# EAGLE board Motor_Test_Bench (EAGLE 9.5.0)
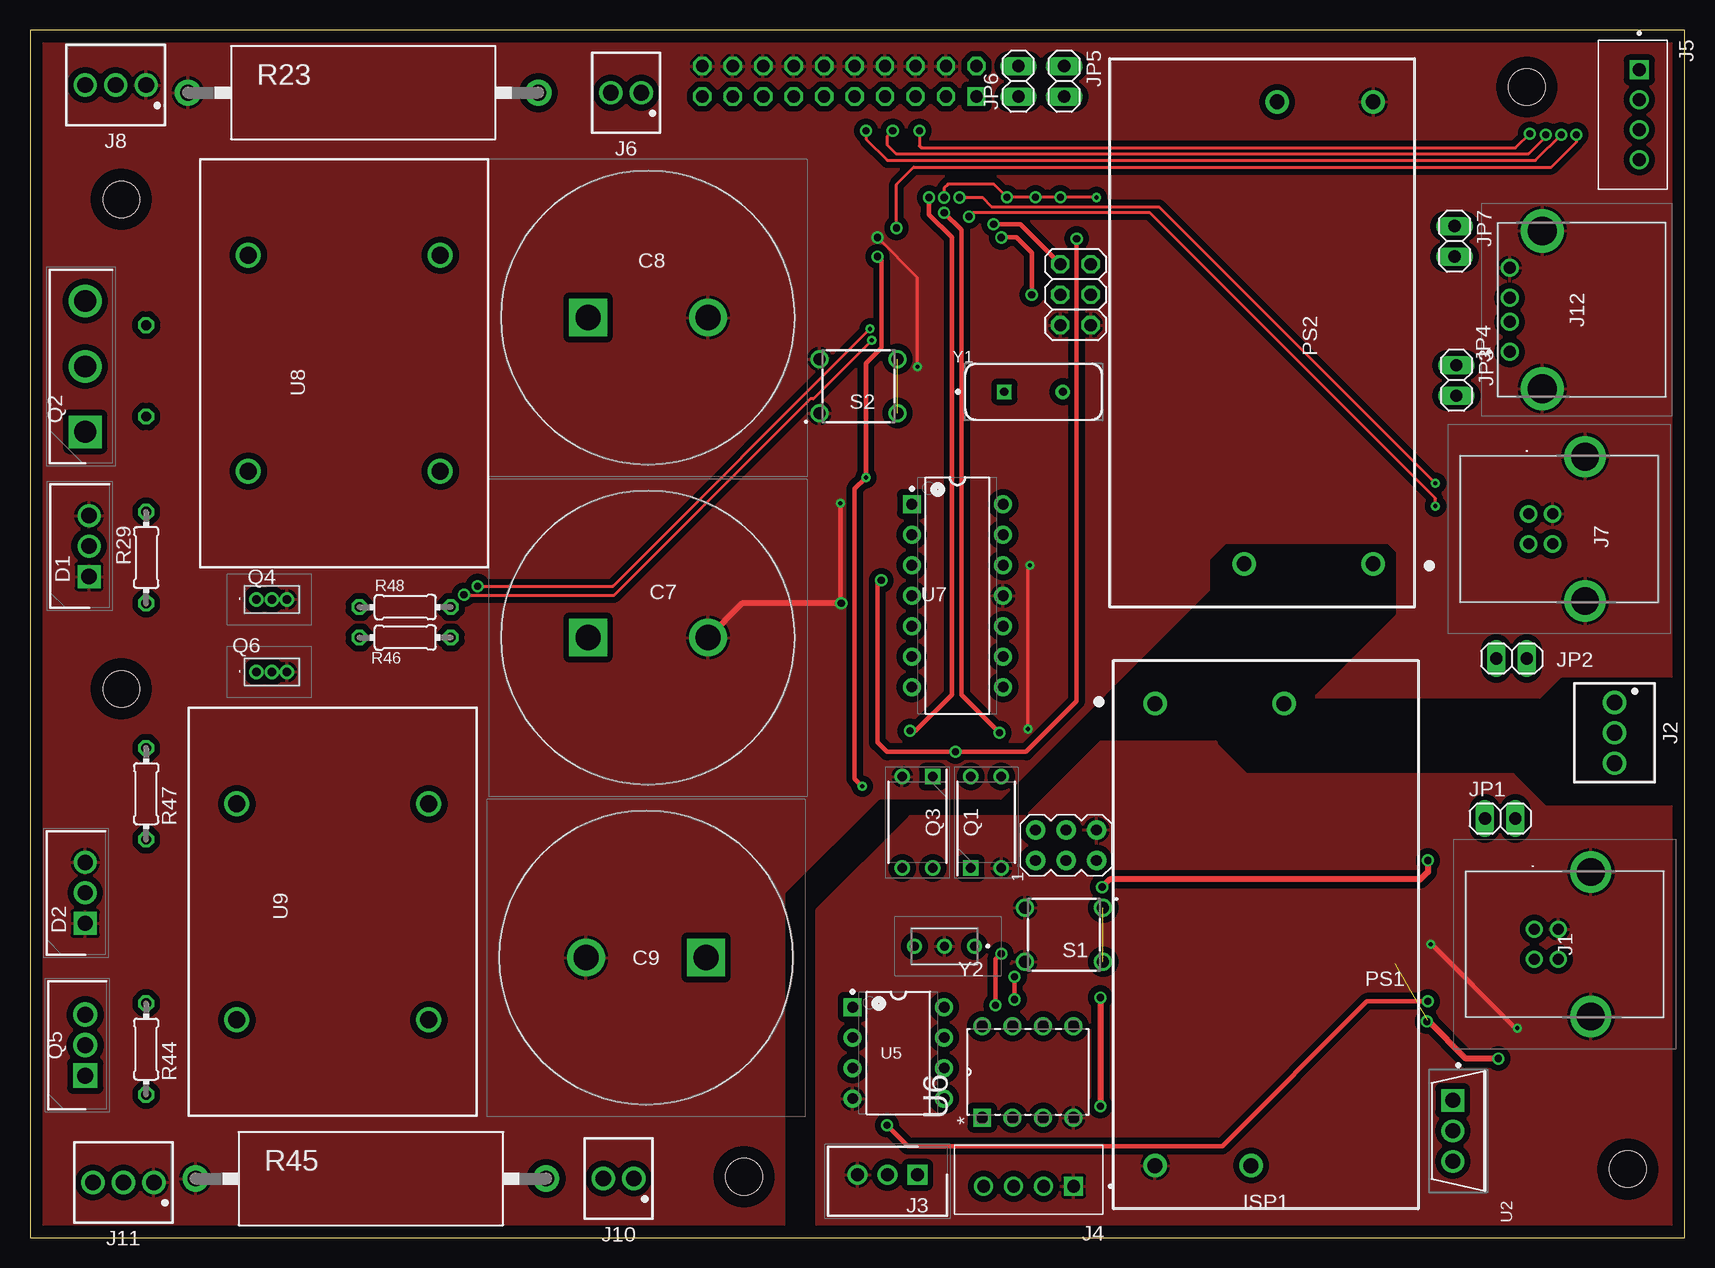
[diagram p5: board, top side]
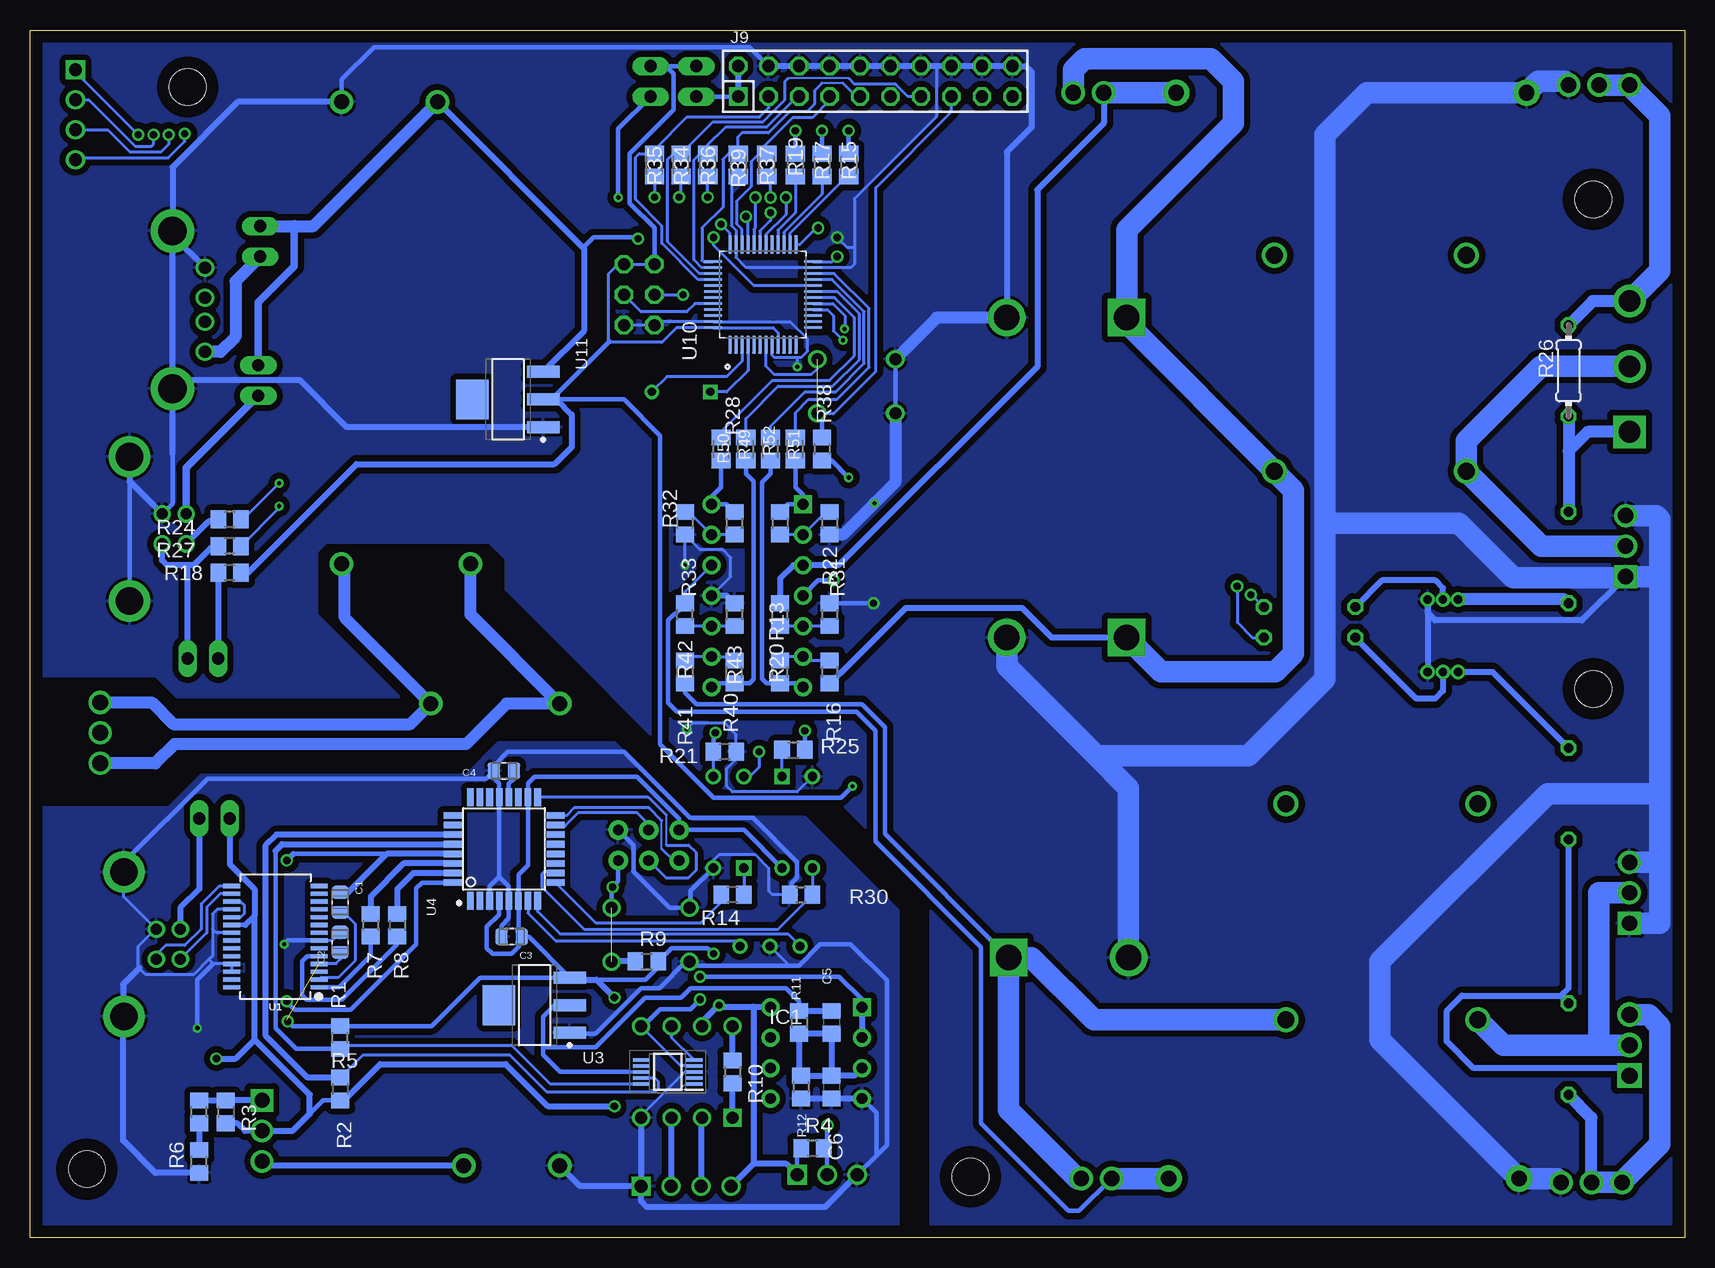
[diagram p6: board, bottom side, seen from below]

Size 137.93 x 100.63 mm. Coordinates in mm from the lower left corner, seen from the top.
Outline: 0,0 137.93,0 137.93,100.63 0,100.63 0,0
Copper layers (1*16): Top 0.035mm / dielectric 1.5mm / Bottom 0.035mm
Design rules "default": minimum track width 6mil, minimum drill 0.35mm, track to track 6mil, track to pad 6mil, pad to pad 6mil, via to via 6mil, smd to smd 6mil, copper to edge 40mil, drill to drill 6mil, minimum pad ring 10mil, minimum via ring 8mil, stop-mask expansion 4mil, vias tented up to drill 0mil, thermal gap 10mil
Holes 3.05 mm at 7.62,86.52 7.62,45.72 59.53,5.08 133.19,5.72 124.78,95.88

## Footprints (pad centres in the part's own frame; a part is rotated, then mirrored left to right if it is on the bottom)
CAP_0805 = smd 1.05 x 1.38: 1 -0.84,0; 2 0.84,0
C0805 = smd 1.3 x 1.5: 1 -0.95,0; 2 0.95,0
SLPX102M200C4P3 = drill 2.1 pad 3.15 square: 1 0,0 | drill 2.1 pad 3.15: 2 10,0
TO254P490X1000X2143-3P = drill 1.28 pad 1.92 square: 1 0,0 | drill 1.28 pad 1.92: 2 2.54,0; 3 5.08,0
SOP50P490X110-10N = smd 1.4 x 0.3: 1 -2.2,1; 2 -2.2,0.5; 3 -2.2,0; 4 -2.2,-0.5; 5 -2.2,-1; 6 2.2,-1; 7 2.2,-0.5; 8 2.2,0; 9 2.2,0.5; 10 2.2,1
AVRISP = drill 0.9 pad 1.626: 1 -1.27,2.54; 2 1.27,2.54; 3 -1.27,0; 4 1.27,0; 5 -1.27,-2.54; 6 1.27,-2.54
UJ2BH1TH = drill 0.92 pad 1.431: 1 1.25,10.81; 2 -1.25,10.81; 3 -1.25,8.81; 4 1.25,8.81 | drill 2.3 pad 3.45: MH1 -6.02,6.1; MH2 6.02,6.1
691210910003 = drill 1.3: 1 -2.54,0; 2 0,0; 3 2.54,0
SHDR3W64P0X250_1X3_990X575X700 = drill 1.1 pad 1.65 square: 1 0,0 | drill 1.1 pad 1.65: 2 2.5,0; 3 5,0
JST_B4B-XH-A(LF)(SN) = drill 1.06 square: 1 0,0 | drill 1.06: 2 2.5,0; 3 5,0; 4 7.5,0
691210910002 = drill 1.3: 1 -1.27,0; 2 1.27,0
JTAG-20 = drill 1.016 square: 1 -11.43,-1.27 | drill 1.016 octagon: 2 -11.43,1.27; 3 -8.89,-1.27; 4 -8.89,1.27; 5 -6.35,-1.27; 6 -6.35,1.27; 7 -3.81,-1.27; 8 -3.81,1.27; 9 -1.27,-1.27; 10 -1.27,1.27; 11 1.27,-1.27; 12 1.27,1.27; 13 3.81,-1.27; 14 3.81,1.27; 15 6.35,-1.27; 16 6.35,1.27; 17 8.89,-1.27; 18 8.89,1.27; 19 11.43,-1.27; 20 11.43,1.27
SS52100001 = drill 1.02 pad 1.53: 1 0,0; 2 2.5,0; 3 4.5,0; 4 7,0 | drill 2.4 pad 3.6: MH1 -3.07,-2.71; MH2 10.07,-2.71
1X02 = drill 1.016 long: 1 -1.27,0; 2 1.27,0
2X03 = drill 1.016 octagon: 1 -2.54,-1.27; 2 -2.54,1.27; 3 0,-1.27; 4 0,1.27; 5 2.54,-1.27; 6 2.54,1.27
IRM-10 = drill 1.24 pad 1.95: 1 3.6,3.45; 2 42.1,3.45; 3 42.1,11.45; 4 3.6,14.2
DIP762W58P254L450H584Q4N = drill 0.78 pad 1.18 square: 1 -3.81,1.27 | drill 0.78 pad 1.18: 2 -3.81,-1.27; 3 3.81,-1.27; 4 3.81,1.27
TO545P521X1594X2566-3P = drill 1.81 pad 2.715 square: 1 0,0 | drill 1.81 pad 2.715: 2 5.45,0; 3 10.9,0
ZTX458 = drill 0.7 pad 1.1: 1 0,0; 2 1.27,0; 3 2.54,0
TO254P483X1028X1700-3P = drill 1.36 pad 2.04 square: 1 0,0 | drill 1.36 pad 2.04: 2 2.54,0; 3 5.08,0
R0805 = smd 1.3 x 1.5: 1 -0.95,0; 2 0.95,0
M0805 = smd 1.3 x 1.6: 1 -0.95,0; 2 0.95,0
RS05_69-70 = drill 1.3 pad 2.2: 1 -14.605,0; 2 14.605,0
0204/7 = drill 0.813 octagon: 1 -3.81,0; 2 3.81,0
1825910-6 = drill 1 pad 1.5: 1 3.25,2.25; 2 3.25,-2.25; 3 -3.25,2.25; 4 -3.25,-2.25
SSOP28DB = smd 0.348 x 1.397: 1 -4.225,-3.656; 2 -3.575,-3.656; 3 -2.925,-3.656; 4 -2.275,-3.656; 5 -1.625,-3.656; 6 -0.975,-3.656; 7 -0.325,-3.656; 8 0.325,-3.656; 9 0.975,-3.656; 10 1.625,-3.656; 11 2.275,-3.656; 12 2.925,-3.656; 13 3.575,-3.656; 14 4.225,-3.656; 15 4.225,3.656; 16 3.575,3.656; 17 2.925,3.656; 18 2.275,3.656; 19 1.625,3.656; 20 0.975,3.656; 21 0.325,3.656; 22 -0.325,3.656; 23 -0.975,3.656; 24 -1.625,3.656; 25 -2.275,3.656; 26 -2.925,3.656; 27 -3.575,3.656; 28 -4.225,3.656
ON_SEMI_LM317BTG_0 = drill 1.25 pad 1.9 square: 1 -0.467,2.54 | drill 1.25 pad 1.9: 2 -0.467,0; 3 -0.467,-2.54
NATIONAL_SEMICONDUCTOR_LM1117IMPX-3.3-NOPB_2 = smd 2.7 x 1: 1 -2.95,2.3; 2 -2.95,0; 3 -2.95,-2.3 | smd 2.7 x 3.3: 4 2.95,0
QFP80P900X900X120-32N = smd 1.5 x 0.55: 1 -4.3,2.8; 2 -4.3,2; 3 -4.3,1.2; 4 -4.3,0.4; 5 -4.3,-0.4; 6 -4.3,-1.2; 7 -4.3,-2; 8 -4.3,-2.8; 17 4.3,-2.8; 18 4.3,-2; 19 4.3,-1.2; 20 4.3,-0.4; 21 4.3,0.4; 22 4.3,1.2; 23 4.3,2; 24 4.3,2.8 | smd 0.55 x 1.5: 9 -2.8,-4.3; 10 -2,-4.3; 11 -1.2,-4.3; 12 -0.4,-4.3; 13 0.4,-4.3; 14 1.2,-4.3; 15 2,-4.3; 16 2.8,-4.3; 25 2.8,4.3; 26 2,4.3; 27 1.2,4.3; 28 0.4,4.3; 29 -0.4,4.3; 30 -1.2,4.3; 31 -2,4.3; 32 -2.8,4.3
TEXAS_INSTRUMENTS_TLC2262CP_0 = drill 0.9 pad 1.5 square: 1 -3.81,3.81 | drill 0.9 pad 1.5: 2 -3.81,1.27; 3 -3.81,-1.27; 4 -3.81,-3.81; 5 3.81,-3.81; 6 3.81,-1.27; 7 3.81,1.27; 8 3.81,3.81
DIP254P762X533-8 = drill 0.991 square: 1 -7.62,7.62 | drill 0.991: 2 -7.62,5.08; 3 -7.62,2.54; 4 -7.62,0; 5 0,0; 6 0,2.54; 7 0,5.08; 8 0,7.62
TEXAS_INSTRUMENTS_TLC2264CN_0 = drill 0.9 pad 1.5 square: 1 -3.81,7.62 | drill 0.9 pad 1.5: 2 -3.81,5.08; 3 -3.81,2.54; 4 -3.81,0; 5 -3.81,-2.54; 6 -3.81,-5.08; 7 -3.81,-7.62; 8 3.81,-7.62; 9 3.81,-5.08; 10 3.81,-2.54; 11 3.81,0; 12 3.81,2.54; 13 3.81,5.08; 14 3.81,7.62
SC-10-30J = drill 1.4 pad 2.1: 1 -9,-8; 2 9,-8; 3 9,8; 4 -9,8
QFP50P900X900X160-48N = smd 1.56 x 0.28: 1 -4.18,2.75; 2 -4.18,2.25; 3 -4.18,1.75; 4 -4.18,1.25; 5 -4.18,0.75; 6 -4.18,0.25; 7 -4.18,-0.25; 8 -4.18,-0.75; 9 -4.18,-1.25; 10 -4.18,-1.75; 11 -4.18,-2.25; 12 -4.18,-2.75; 25 4.18,-2.75; 26 4.18,-2.25; 27 4.18,-1.75; 28 4.18,-1.25; 29 4.18,-0.75; 30 4.18,-0.25; 31 4.18,0.25; 32 4.18,0.75; 33 4.18,1.25; 34 4.18,1.75; 35 4.18,2.25; 36 4.18,2.75 | smd 0.28 x 1.56: 13 -2.75,-4.18; 14 -2.25,-4.18; 15 -1.75,-4.18; 16 -1.25,-4.18; 17 -0.75,-4.18; 18 -0.25,-4.18; 19 0.25,-4.18; 20 0.75,-4.18; 21 1.25,-4.18; 22 1.75,-4.18; 23 2.25,-4.18; 24 2.75,-4.18; 37 2.75,4.18; 38 2.25,4.18; 39 1.75,4.18; 40 1.25,4.18; 41 0.75,4.18; 42 0.25,4.18; 43 -0.25,4.18; 44 -0.75,4.18; 45 -1.25,4.18; 46 -1.75,4.18; 47 -2.25,4.18; 48 -2.75,4.18
FOX_ELECTRONICS_FOXSLF-080-20_0 = drill 0.7 pad 1.2 square: 1 -2.44,0 | drill 0.7 pad 1.2: 2 2.44,0
CSTLS16M0X53ZA0 = drill 0.73 pad 1.251: 1 0,0; 2 -2.5,0; 3 -5,0

## Placement (x,y rotation side)
C1  100n  [CAP_0805]  112.08,27.94 270 bottom
C2  100n  [CAP_0805]  112.08,24.61 90 bottom
C3  100n  [CAP_0805]  97.79,25.08 180 bottom
C4  100n  [CAP_0805]  98.42,38.89 180 bottom
C5  100n  [C0805]  71.12,17.94 270 bottom
C6  100n  [C0805]  71.12,12.54 270 bottom
C7  1000µ  [SLPX102M200C4P3]  46.51,50.01 0 top
C8  1000µ  [SLPX102M200C4P3]  46.51,76.68 0 top
C9  1000µ  [SLPX102M200C4P3]  56.36,23.34 180 top
D1  MBRF10200CT  [TO254P490X1000X2143-3P]  4.92,55.09 90 top
D2  MBRF10200CT  [TO254P490X1000X2143-3P]  4.6,26.19 90 top
IC1  ADS1115BQDGSRQ1  [SOP50P490X110-10N]  84.77,13.81 180 bottom
ISP1  AVRISP-6  [AVRISP]  86.36,32.7 90 top
J1  UJ2-BH-1-TH  [UJ2BH1TH]  136.21,24.45 90 top
J2  [691210910003]  132.08,42.07 270 top
J3  B3B-XH-A(LF)(SN)  [SHDR3W64P0X250_1X3_990X575X700]  73.98,5.24 180 top
J4  B4B-XH-A(LF)(SN)  [JST_B4B-XH-A(LF)(SN)]  87,4.29 180 top
J5  B4B-XH-A(LF)(SN)  [JST_B4B-XH-A(LF)(SN)]  134.14,97.31 270 top
J6  [691210910002]  49.69,95.41 180 top
J7  UJ2-BH-1-TH  [UJ2BH1TH]  135.73,59.05 90 top
J8  [691210910003]  7.14,96.04 180 top
J9  JTAG-20  [JTAG-20]  67.47,96.36 0 bottom
J10  [691210910002]  49.05,4.92 180 top
J11  [691210910003]  7.78,4.6 180 top
J12  SS-52100-001  [SS52100001]  123.35,73.82 90 top
JP1  [1X02]  122.55,34.92 0 top
JP2  [1X02]  123.51,48.26 0 top
JP3  [1X02]  118.9,71.44 270 top
JP4  [2X03]  87.15,78.58 270 top
JP5  [1X02]  86.2,96.36 270 top
JP6  [1X02]  82.39,96.36 270 top
JP7  [1X02]  118.75,83.03 270 top
PS1  IRM-10-12  [IRM-10]  90.33,48.1 270 top
PS2  IRM-10-5  [IRM-10]  115.41,52.55 90 top
Q1  TIL191  [DIP762W58P254L450H584Q4N]  79.69,34.61 90 top
Q2  IXTX32P60P  [TO545P521X1594X2566-3P]  4.6,67.15 90 top
Q3  TIL191  [DIP762W58P254L450H584Q4N]  73.98,34.61 270 top
Q4  ZTX458  [ZTX458]  18.89,53.18 0 top
Q5  IXTP10P50P  [TO254P483X1028X1700-3P]  4.6,13.49 90 top
Q6  ZTX458  [ZTX458]  18.89,47.15 0 top
R1  10k  [R0805]  112.08,16.67 90 bottom
R2  10k  [R0805]  112.08,12.38 270 bottom
R3  240  [R0805]  121.6,10.48 270 bottom
R4  10k  [R0805]  72.71,7.46 0 bottom
R5  680  [R0805]  123.83,10.48 90 bottom
R6  47  [R0805]  123.83,6.35 90 bottom
R7  1k  [R0805]  109.54,26.04 270 bottom
R8  1k  [R0805]  107.31,26.04 270 bottom
R9  10k  [R0805]  86.52,23.02 0 bottom
R10  100  [R0805]  79.38,13.81 270 bottom
R11  10k  [R0805]  73.82,17.94 270 bottom
R12  10k  [R0805]  73.66,12.54 270 bottom
R13  1k2  [R0805]  75.41,47.15 90 bottom
R14  100  [R0805]  79.38,28.58 180 bottom
R15  33  [M0805]  69.69,89.38 90 bottom
R16  470k  [R0805]  71.28,47.15 270 bottom
R17  33  [M0805]  71.91,89.38 90 bottom
R18  1k5  [R0805]  121.28,55.4 180 bottom
R19  33  [M0805]  74.14,89.38 90 bottom
R20  470k  [R0805]  75.41,51.91 90 bottom
R21  10k  [R0805]  80.01,40.48 180 bottom
R22  1k2  [R0805]  71.28,51.91 270 bottom
R23  0R05  [RS05_69-70]  27.78,95.41 0 top
R24  22  [R0805]  121.28,59.85 180 bottom
R25  100  [R0805]  74.3,40.64 0 bottom
R26  1k  [0204/7]  9.68,72.23 90 bottom
R27  22  [R0805]  121.28,57.63 180 bottom
R28  560k  [R0805]  75.41,59.53 270 bottom
R29  1k  [0204/7]  9.68,56.67 90 top
R30  10k  [R0805]  73.66,28.58 0 bottom
R31  82k  [R0805]  71.28,59.53 270 bottom
R32  560k  [R0805]  79.22,59.53 270 bottom
R33  82k  [R0805]  83.34,59.53 270 bottom
R34  10k  [M0805]  83.66,89.38 270 bottom
R35  10k  [M0805]  85.88,89.38 270 bottom
R36  10k  [M0805]  81.44,89.38 270 bottom
R37  10k  [M0805]  76.52,89.38 270 bottom
R38  10k  [R0805]  71.91,65.72 270 bottom
R39  10k  [M0805]  78.9,89.38 90 bottom
R40  1k2  [R0805]  79.22,47.15 90 bottom
R41  470k  [R0805]  83.34,47.15 270 bottom
R42  470k  [R0805]  83.34,51.91 90 bottom
R43  1k2  [R0805]  79.22,51.91 270 bottom
R44  1k  [0204/7]  9.68,15.72 270 top
R45  0R05  [RS05_69-70]  28.42,4.92 0 top
R46  10k  [0204/7]  31.27,50.01 0 top
R47  1k  [0204/7]  9.68,36.99 270 top
R48  10k  [0204/7]  31.27,52.55 0 top
R49  10k  [M0805]  78.26,65.72 270 bottom
R50  10k  [M0805]  80.33,65.72 270 bottom
R51  10k  [M0805]  74.14,65.72 270 bottom
R52  10k  [M0805]  76.2,65.72 270 bottom
S1  1825910-6  [1825910-6]  86.2,25.24 0 top
S2  1825910-6  [1825910-6]  69.06,70.96 180 top
U1  FT232RL  [SSOP28DB]  117.47,25.08 90 bottom
U2  ON_SEMI_LM317BTGON_SEMI_LM317BTG_0_0  [ON_SEMI_LM317BTG_0]  119.06,8.89 0 top
U3  NATIONAL_SEMICONDUCTOR_LM1117IMPX-3.3-NOPBNATIONAL_SEMICONDUCTOR_LM1117IMPX-3.3-NOPB_0_2  [NATIONAL_SEMICONDUCTOR_LM1117IMPX-3.3-NOPB_2]  95.89,19.37 180 bottom
U4  ATMEGA328P-AN  [QFP80P900X900X120-32N]  98.42,32.38 90 bottom
U5  TEXAS_INSTRUMENTS_TLC2262CPTEXAS_INSTRUMENTS_TLC2262CP_0_0  [TEXAS_INSTRUMENTS_TLC2262CP_0]  72.39,15.4 0 top
U6  AD623ANZ  [DIP254P762X533-8]  87,17.62 90 top
U7  TEXAS_INSTRUMENTS_TLC2264CNTEXAS_INSTRUMENTS_TLC2264CN_0_0  [TEXAS_INSTRUMENTS_TLC2264CN_0]  77.31,53.5 0 top
U8  SC-10-30J  [SC-10-30J]  26.19,72.87 90 top
U9  SC-10-30J  [SC-10-30J]  25.24,27.15 270 top
U10  STM32F103C8T6  [QFP50P900X900X160-48N]  76.83,78.58 90 bottom
U11  NATIONAL_SEMICONDUCTOR_LM1117IMPX-3.3-NOPBNATIONAL_SEMICONDUCTOR_LM1117IMPX-3.3-NOPB_0_2  [NATIONAL_SEMICONDUCTOR_LM1117IMPX-3.3-NOPB_2]  98.11,69.85 180 bottom
Y1  FOX_ELECTRONICS_FOXSLF-080-20FOX_ELECTRONICS_FOXSLF-080-20_0_0  [FOX_ELECTRONICS_FOXSLF-080-20_0]  83.66,70.48 0 top
Y2  CSTLS16M0X53Z-A0  [CSTLS16M0X53ZA0]  78.74,24.29 0 top

## Tracks (layer width: path | path; a pad name or v marks a point on that pad's centre or on a via)
1V65  (via drill 0.6)
  Top 0.381: v82.07,19.84 v82.07,21.75
  Bottom 0.254: IC1.4 83.68,14.31 U6.5
  Bottom 0.381: U5.1 68.58,19.84 70.48,21.75 v82.07,21.75 | v82.07,19.84 82.87,19.05 85.41,19.05 86.84,17.62 U6.5
  Bottom 0.508: U5.1 U5.2
3V3_D
  Bottom 0.254: 87.95,13.81 IC1.8
  Bottom 0.381: R11.1 73.82,19.68 74.93,20.8 82.87,20.8 83.66,20 86.68,20 90.8,15.87 95.16,15.87 | 87.95,13.81 93.73,13.81 95.16,15.24 95.16,15.87 | U3.2 94.2,19.37 95.16,18.41 95.16,15.87
  Bottom 0.508: R11.1 C5.1
3V3_FTDI
  Bottom 0.254: U1.17 120.4,28.01 120.07,27.68 120.07,26.99 120.35,26.71 U1.19
5V_D  (via drill 0.6)  (1 unrouted)
  Top 0.381: v80.96,23.65 80.49,23.18 v80.49,19.37
  Top 0.508: v89.22,20 v89.22,10.95 | v122.4,14.92 119.7,14.92 116.6,18.02 v116.44,18.02
  Bottom 0.254: C2.1 112.08,23.18 112.45,22.81 U1.4 | 116.52,18.1 v116.44,18.02
  Bottom 0.381: J3.1 73.98,7.14 R4.1 | Q3.4 78.42,33.97 ISP1.2 83.82,34.92 87.31,38.42 95.88,38.42 96.42,37.88 U4.18 96.42,31.05 97.22,30.25 U4.6 97.22,25.36 C3.1 | U1.20 119.99,26.06 | C3.1 97.15,24.88 97.15,24.29 97.79,23.65 99.38,23.65 99.85,24.13 99.85,25.89 98.82,26.92 U4.4 | U3.3 100.41,21.67 104.46,17.62 R1.2 112.55,17.62 116.05,17.62 v116.44,18.02 | U3.3 92.76,21.49 86.62,21.49 85.57,22.54 R9.2 84.46,24.13 81.44,24.13 v80.96,23.65 | C3.1 96.35,25.08 U3.3 | 112.24,11.27 R2.2 113.5,11.43 114.62,10.32 | 121.13,35.08 JP1.1 | v80.49,19.37 80.49,19.25
  Bottom 0.508: U6.7 81.91,17.99 80.65,19.25 80.49,19.25 77.63,19.25 | 77.63,19.25 76.24,19.25 U5.8 | 77.63,19.25 77.63,6.15 | 77.63,6.15 J4.4 | J3.1 74.89,6.15 77.63,6.15 | JP1.1 121.28,31.11 119.22,29.05 119.22,26.83 | 119.22,26.83 119.99,26.06 | R3.2 120.65,9.53 120.01,8.89 U2.2 116.05,8.89 114.62,10.32 114.62,11.91 119.22,16.51 | 119.22,16.51 119.22,26.83 | R2.2 111.76,11.43 108.74,14.45 98.27,14.45 94.77,10.95 v89.22,10.95 | v89.22,20 90.72,21.51 92.78,21.51 U3.3 | v122.4,14.92 120.81,14.92 119.22,16.51
5V_RPI
  Bottom 1.016: JP7.2 120.81,79.69 120.81,75.09 122.08,73.82 J12.1
12V_D
  Bottom 0.508: PS1.3 118.25,6 U2.3
230V_N
  Bottom 1.016: PS2.4 101.21,51.93 PS1.1 98.21,44.5 101.6,41.12 125.89,41.12 127.48,39.53 J2.3
230V_P
  Bottom 1.016: PS2.1 111.69,55.88 111.69,51.66 PS1.4 106.24,42.79 125.98,42.79 127.79,44.61 J2.1
+3V3  (via drill 0.35, 0.6)
  Top 0.381: v80.33,84.45 82.55,84.45 JP4.1 | v69.37,37.62 68.74,38.26 68.74,53.34 68.74,62.39 v69.69,63.34 69.69,72.87 70.96,74.14 70.96,81.44 v70.64,81.76
  Bottom 0.254: U10.9 75.58,75.43 75.99,75.83 U10.48 84.03,75.83 85.25,74.61 89.53,74.61 89.61,74.69 89.69,74.77 89.69,80.33 88.9,81.12 JP4.2 JP4.1 | U10.36 79.58,83.71 v80.33,84.45 | U10.24 71.07,81.33 v70.64,81.76
  Bottom 0.381: 89.61,74.69 94.46,69.85 U11.2 88.42,69.85 85.41,66.83 85.41,41.12 80.96,36.67 70.33,36.67 v69.37,37.62 | v69.69,63.34 71.12,64.77 R38.2 | JP4.1 85.88,84.14 87.95,86.2 87.95,90.33 84.3,93.98 84.3,97 84.93,97.63 JP5.1 JP6.1
  Bottom 0.508: R18.1 119.76,55.4 110.71,64.45 94.2,64.45 92.78,65.88 92.78,68.58 94.05,69.85 U11.2
+5V  (via drill 0.6)
  Top 0.381: v87.25,83.25 87.25,44.7 83.03,40.48 v77.15,40.48 71.44,40.48 70.64,41.27 70.64,54.45 v70.96,54.77
  Bottom 0.254: v77.15,40.48 77.15,39.21 77.95,38.42 Q1.4
  Bottom 0.381: 91.81,82.5 90.96,83.34 87.34,83.34 v87.25,83.25 | v70.96,54.77 72.23,54.77 U7.4
  Bottom 0.508: PS2.3 91.81,82.5 91.76,82.44 91.76,75.55 U11.3
  Bottom 0.635: 115.9,84.3 115.9,80.95 118.9,77.95 JP3.1
  Bottom 1.016: PS2.3 114.31,84.3 115.9,84.3 JP7.1
BOOT0
  Bottom 0.254: U10.44 82.51,77.83 83.18,77.15 86.99,77.15 JP4.4
BOOT1  (via drill 0.6)
  Top 0.381: v80.96,83.34 82.23,83.34 83.5,82.07 v83.5,78.58
  Bottom 0.254: U10.20 77.58,79.33 80.96,82.71 v80.96,83.34 | JP4.3 v83.5,78.58
GND  (via drill 0.35, 0.6)
  Top 0.254: v73.98,72.57 73.98,80.01 v70.64,83.34 | v83.18,42.39 83.18,55.88 v83.34,56.04
  Top 0.381: v67.55,61.2 67.55,52.94 v67.63,52.86
  Top 0.508: v67.63,52.86 59.37,52.86 C7.2
  Bottom 0.254: U7.11 79.53,55.09 79.53,56.67 80.17,57.31 82.07,57.31 83.26,58.5 | 83.26,58.5 R33.2 | R39.1 79.46,87.86 79.46,84.34 79.08,83.96 U10.35 79.08,81.68 78.24,80.83 U10.23 69.5,80.83 69.21,81.12 69.21,82.55 | Q3.2 73.98,37.15 79.37,37.15 79.85,37.62 79.85,39.05 79.06,39.85 R21.1 79.06,41.91 80.01,42.86 82.71,42.86 v83.18,42.39 | 73.98,73.34 73.66,73.34 73.18,73.82 73.18,74.93 74.58,76.33 U10.47 85.59,76.33 JP4.5 JP4.6 | 73.98,73.34 75.88,73.34 76.08,73.54 U10.8 | 62.39,97.63 62.39,93.41 69.21,86.58 69.21,82.55 | 73.98,73.34 v73.98,72.57 | v70.64,83.34 69.85,82.55 69.21,82.55 | v83.34,56.04 83.34,58.42 83.26,58.5
  Bottom 0.381: J7.MH2 J7.MH1 | J7.4 126.06,61.17 126.06,65.34 | J9.4 77.94,99.21 109.26,99.21 111.96,96.51 PS2.2 | v67.63,52.86 R22.1 | S2.2 S2.1
  Bottom 0.508: PS2.2 120.62,94.65 126.06,89.21 J12.MH2 126.06,83.5 | J12.MH1 126.06,83.5 | 126.06,65.34 J12.MH1 | J9.4 J9.6 J9.8 J9.10 J9.12 J9.14 62.39,97.63 J9.16 J9.18 J9.20 54.93,97.63 54.45,97.15 54.45,92.55 56.51,90.49 C8.2 | R43.1 79.85,53.5 U7.11 | J7.MH2 129.63,63.01 J7.4 | J12.4 126.03,83.5 126.06,83.5 | U11.1 111.52,67.55 115.41,71.44 125.37,71.44 J12.MH1 | Q6.3 Q4.3 21.43,52.07 20.8,51.43 8.57,51.43 D1.1
  Bottom 1.016: C8.2 62.34,76.68 S2.2 | S2.1 65.81,62.94 v67.55,61.2 70.17,58.58 R31.2
  Bottom 1.778: 30,59.53 30,91.92 26.51,95.41 R23.1 12.22,96.36 10,96.36 J8.1 | 30,59.53 30,46.51 36.35,40.16 49.05,40.16 | C7.2 56.51,47.62 49.05,40.16 | D1.3 2.38,60.17 2.06,59.85 2.06,55.09 | 2.06,55.09 D1.1 5.02,54.99 14.27,54.99 18.81,59.53 30,59.53 | 2.06,30.96 2.38,31.27 D2.3 | 2.06,30.96 2.06,26.19 D2.1 | 2.06,30.96 2.06,36.99 | 2.06,36.99 2.06,55.09 | J11.1 10.64,4.92 R45.1 25.4,16.51 25.4,23.02 11.43,36.99 2.06,36.99 | C9.2 46.36,37.47 49.05,40.16
  pour Bottom (isolate 0.508): 0,0 0,100.49 137.79,100.49 137.79,46.83 127.48,46.83 125.73,45.09 107.16,45.09 113.98,51.91 113.98,57.15 113.19,57.94 99.69,57.94 98.27,56.52 98.27,53.97 80.96,36.67 70.8,36.67 62.87,28.73 62.87,0
  pour Top (isolate 0.508): 137.79,100.65 0,100.65 0,0 62.71,0 62.87,-0.16 62.87,28.73 70.8,36.67 80.96,36.67 98.27,53.97 98.27,56.52 99.69,57.94 113.19,57.94 113.98,57.15 113.98,51.91 107.16,45.09 125.89,45.09 127.64,46.83 137.79,46.83
GND_BRK
  Bottom 0.254: U7.12 83.34,53.82 R42.2 83.34,52.76 83.45,52.65
  Bottom 0.381: J10.2 50.48,2.22 51.36,2.22 58.66,9.52 58.66,24.21 67.47,33.02 67.47,42.23 69.06,43.81 83.98,43.81 84.75,44.59 84.75,51.44 84.24,51.95 84.15,51.95 83.45,52.65
  Bottom 1.778: R45.2 J10.2
GND_D  (via drill 0.35)
  Top 0.381: v123.98,17.46 123.82,17.46 116.84,24.45 v116.75,24.45
  Bottom 0.152: 74.79,22.84 74.62,22.67
  Bottom 0.254: R30.1 76.04,28.57 76.36,28.89 76.36,30.8 77.47,31.91 80.49,31.91 80.96,31.43 Q1.2 | IC1.3 83.34,13.81 86.99,10.16 U6.4 | U1.18 122.34,27.36 122.71,26.99 122.71,25.72 | 122.71,25.72 122.71,23.49 123.03,23.18 | 123.03,23.18 124.3,21.91 128.27,21.91 128.83,22.46 128.9,22.54 128.9,24.29 127.5,25.7 J1.4 130.11,28.41 J1.MH2 130.11,31.28 | U1.26 U1.25 122.66,22.81 123.03,23.18 | U1.21 122.4,25.41 122.71,25.72 | C2.2 112.77,24.76 U1.7 | Y2.2 74.79,22.84
  Bottom 0.381: 67.39,6.83 67.39,10.4 U5.4 | J3.3 67.39,6.83 | ISP1.6 87.63,32.7 87.63,30.48 84.64,27.49 S1.3 82.87,27.49 82.87,28.89 Q1.2 | C4.2 99.26,38.3 98.82,37.86 U4.21 98.82,30.08 | U4.3 99.62,29.28 98.82,30.08 | 98.82,30.08 98.02,29.28 U4.5 98.02,26.59 98.63,25.99 C3.2 | R30.1 74.45,28.73 74.45,29.53 73.98,30 73.98,31.27 77.67,34.97 82.91,34.97 88.42,40.48 98.11,40.48 99.26,39.32 C4.2 | S1.4 83.59,22.99 | U3.1 92.85,16.99 90.8,16.99 86.99,20.8 85.46,20.8 83.27,22.99 S1.4 | S1.4 82.63,22.67 74.62,22.67 73.85,22.67 72.07,24.45 69.53,24.45 66.52,21.43 66.52,7.7 67.39,6.83 | 122.66,22.81 123.98,21.48 v123.98,17.46 | v116.75,24.45 116.44,24.76 U1.7 | C4.2 99.9,38.25 123.14,38.25 130.11,31.28
  Bottom 0.508: U5.4 C6.2 R12.2 | U6.4 J4.1 | J4.1 92.06,4.29 PS1.2 | R6.1 127.48,5.4 130.17,8.1 130.17,18.36 | 130.17,18.36 J1.MH1 | 128.83,22.46 130.17,21.11 130.17,18.36 | J3.3 71.68,2.54 86.52,2.54 86.99,3.02 J4.1
  pour Bottom (isolate 0.508): 137.95,35.88 126.36,35.88 123.67,38.58 101.6,38.58 98.9,41.27 89.22,41.27 83.03,35.08 73.34,35.08 65.56,27.3 65.56,0 137.95,0
  pour Top (isolate 0.508): 137.95,0 137.95,35.88 126.36,35.88 123.67,38.58 101.44,38.58 98.9,41.12 98.9,41.27 89.22,41.27 83.03,35.08 73.34,35.08 65.56,27.3 65.56,0
GND_MOT
  Bottom 0.508: J6.2 48.42,92.87 53.97,87.31 53.97,72.59 70.53,56.04 U7.3 74.29,56.04 75.41,54.93 R20.2
  Bottom 1.778: R23.2 J6.2
IN_100V_BRAKE
  Bottom 1.016: J11.2 7.78,10 R44.2
  Bottom 1.778: Q5.3 3.02,18.57 2.06,17.62 2.06,7.78 J11.3 J11.2
IN_100V_MOTOR
  Bottom 1.016: Q2.3 7.67,78.05 R26.2
  Bottom 1.778: Q2.3 2.06,80.59 2.06,93.5 J8.3 J8.2
JNTRST
  Bottom 0.254: J9.3 76.36,94.14 77.15,93.34 83.18,93.34 85.88,90.65 R35.1 | R35.1 | R35.1 87.15,90.33 87.47,90.01 87.47,86.52 85.25,84.3 85.25,82.85 82.23,79.83 U10.40
JTCK
  Bottom 0.152: 70.17,96.2 71.91,96.2
  Bottom 0.254: 70.17,96.2 69.06,95.09 J9.9 | U10.37 81.81,81.33 81.91,81.44 81.91,84.14 80.17,85.88 80.17,89.85 79.69,90.33 R39.2 78.9,91.74 78.58,92.05 76.38,92.05 74.61,93.82 73.18,93.82 72.55,94.46 72.55,95.57 71.91,96.2
JTDI
  Bottom 0.254: J9.5 73.98,95.09 76.54,92.53 79.97,92.53 81.44,91.06 R36.1 82.07,90.33 82.58,89.82 82.58,81.47 81.94,80.83 U10.38
JTDO
  Bottom 0.152: 69.68,96.61 74.73,96.61
  Bottom 0.254: J9.13 64.73,95.09 65.77,96.13 69.21,96.13 69.68,96.61 | 74.73,96.61 75.02,96.32 75.02,94.8 76.88,92.94 81.05,92.94 R34.1 84.3,90.33 84.77,89.85 84.77,82.98 82.13,80.33 U10.39
JTMS
  Bottom 0.254: U10.34 78.58,84.03 79.06,84.5 79.06,86.36 77.79,87.63 77.79,89.69 77.15,90.33 76.83,90.33 | 76.83,90.33 R37.1 | J9.7 71.28,94.77 72.72,93.33 74.37,93.33 76.83,90.87 76.83,90.33
LOAD_CELL_NEG
  Bottom 0.508: U6.2 81.99,9.92 J4.3
LOAD_CELL_POS
  Bottom 0.508: U6.3 84.49,9.96 J4.2
MES_I_BRAKE
  Bottom 0.254: R50.1 80.33,67.15 76.04,71.44 71.28,71.44 69.21,73.5 69.21,76.68 70.87,78.33 U10.18
MES_I_MOTOR
  Bottom 0.254: R51.1 74.14,68.74 73.02,69.85 70.67,69.85 68,72.52 68,77.43 70.89,80.33 U10.22
MES_LOAD_CELL
  Bottom 0.254: U6.6 84.48,17.6 84.48,16.72 IC1.5
MES_U_BRAKE
  Bottom 0.254: R49.1 78.26,68.26 75.56,70.96 71.02,70.96 68.81,73.17 68.81,77 70.64,78.83 U10.19
MES_U_MOTOR
  Bottom 0.254: R52.1 76.2,67.62 73.34,70.48 70.76,70.48 68.4,72.85 68.4,77.17 71.06,79.83 U10.21
MISO_ATM
  Bottom 0.152: 85.27,32.4 85.27,34.74
  Bottom 0.254: ISP1.1 84.3,31.43 85.27,32.4 | U4.16 93.18,35.18 92.56,35.81 86.33,35.81 85.27,34.74
MOSI_ATM
  Bottom 0.254: ISP1.4 86.36,34.45 87.31,35.4 92.23,35.4 93.32,34.31 94.05,34.31 U4.15
N$1
  Bottom 1.778: Q2.2 12,72.6 18.19,66.41 U8.4 11.95,57.63 D1.2
N$3
  Bottom 0.508: R5.1 R6.2
N$5
  Bottom 0.508: U2.1 R3.1 R5.2
N$6
  Bottom 0.508: R24.2 122.39,59.69 123.04,59.69 J7.2
N$7
  Bottom 0.508: R27.2 122.39,57.47 122.87,57.47 124.3,56.04 124.78,56.04 | 124.78,56.04 126.52,56.04 126.92,56.44 J7.3 | JP2.2 124.78,56.04
N$8
  Bottom 0.508: R18.2 JP2.1
N$9
  Bottom 0.254: R28.2 U7.2 71.6,60.48 R31.1
N$10
  Bottom 1.016: Q2.1 8.1,67.15 9.68,65.56 | R26.1 9.68,65.56 | 9.68,65.56 R29.2
N$11
  Bottom 1.016: R29.1 10,53.18 Q4.1
N$12
  Bottom 0.254: R13.2 75.09,48.42 U7.6 73.18,48.1 R16.1
N$13
  Bottom 0.254: R22.2 U7.5 R20.1
N$14
  Bottom 0.254: U1.2 113.62,21.7 112.2,21.7 110.79,23.11 110.79,26.1 111.79,27.1 C1.2
N$15
  Bottom 0.381: C4.1 97.58,38.26 98.02,37.82 U4.20
N$16
  Bottom 0.508: Q5.1 5.24,14.13 17.62,14.13 19.84,16.35 19.84,18.89 18.57,20.16 10.32,20.16 | R44.1 10.32,20.16 | 10.32,20.16 9.68,20.8 R47.2
N$17
  Bottom 0.254: R32.2 U7.13 83.02,60.48 R33.1
N$18
  Bottom 0.508: Q6.2 20.16,45.56 20.8,44.93 22.38,44.93 R46.1
N$19
  Bottom 0.254: R43.2 U7.10 R42.1
N$20
  Bottom 0.254: R40.2 79.54,48.42 U7.9 83.02,48.42 R41.1
N$21
  Bottom 0.508: Q4.2 20.16,54.13 20.8,54.77 25.24,54.77 R48.1
N$22
  Bottom 0.508: Q6.1 16.03,47.15 R47.1
N$23
  Bottom 0.254: 74.14,64.61 R51.2
  Bottom 0.381: R28.1 74.77,61.12 U7.1 73.5,61.91 74.14,62.55 74.14,64.61
N$25
  Bottom 0.254: J1.2 123.19,25.4 123.19,27.53 122.07,28.66 U1.16
N$26
  Bottom 0.508: U6.1 R10.2
N$27
  Bottom 0.508: C6.1 R12.1 73.82,13.65 R11.2 C5.2 C6.1 | U5.3 69.22,13.49 C6.1
N$28
  Bottom 0.508: R10.1 U6.8
N$29
  Bottom 0.254: J1.3 127.4,23.56 126.6,24.35 125.03,24.35 123.67,25.72 123.67,27.78 122.14,29.31 U1.15
N$32
  Bottom 1.778: D2.2 7.14,28.73 7.14,16.03 | 7.14,16.03 Q5.2 | 7.14,16.03 9.68,16.03 10,16.03 15.13,16.03 U9.2
N$34
  Bottom 0.254: Q1.1 R14.1
N$35
  Bottom 0.254: Q3.1 R25.1
N$36
  Bottom 0.635: JP3.2 124.92,64.15 J7.1
N$37
  Bottom 0.381: JP6.2 J9.1
  Bottom 0.508: J9.2 J9.1
N$38  (via drill 0.35, 0.6)
  Top 0.254: v85.88,86.7 85.86,86.68 83.84,86.68 v83.82,86.7 83.8,86.68 81.46,86.68 v81.44,86.7 80.35,87.79 76.52,87.79 76.2,87.47 v76.2,86.68 | v88.9,86.68 85.91,86.68
  Top 0.381: 85.91,86.68 v85.88,86.7
  Bottom 0.254: R35.2 v85.88,86.7 | v83.82,86.7 83.66,86.86 R34.2 | v81.44,86.7 R36.2 | v76.2,86.68 76.2,88.11 R37.2
  Bottom 0.381: JP5.2 88.9,92.39 v88.9,86.68
N$39
  Bottom 0.508: JP1.2 123.82,29.05 125.4,27.48 J1.1
N$40  (via drill 0.6)
  Top 0.254: v69.69,92.23 69.69,91.55 71.48,89.76 125.48,89.76 v127.63,91.92
  Bottom 0.254: J5.2 133.03,94.81 129.18,90.96 127.79,90.96 127.63,91.12 v127.63,91.92
  Bottom 0.381: v69.69,92.23 R15.2
N$41  (via drill 0.6)
  Top 0.254: v71.91,92.23 71.46,91.78 71.46,91.05 72.18,90.33 124.94,90.33 126.36,91.76 v126.36,91.92
  Bottom 0.254: J5.3 131.44,92.31 129.62,90.49 127,90.49 126.36,91.12 v126.36,91.92
  Bottom 0.381: v71.91,92.23 R17.2
N$42  (via drill 0.6)
  Top 0.254: v74.14,92.23 74.14,90.96 74.29,90.8 123.82,90.8 125,91.98 v125.03,91.98
  Bottom 0.254: v125.03,91.98 125.03,91.35 126.4,89.97 133.98,89.97 J5.4
  Bottom 0.381: v74.14,92.23 R19.2
N$43
  Bottom 0.254: U10.4 78.08,72.25 79.85,70.48 Y1.1
N$44
  Bottom 0.254: U10.3 78.58,73.02 79.85,71.75 84.83,71.75 Y1.2
N$45
  Bottom 0.381: R32.1 79.85,61.12 U7.14 81.12,61.75 80.33,62.55 R50.2
N$46
  Bottom 0.381: U7.8 80.8,46.2 R40.1 77.94,46.2 77.63,46.51 77.63,63.02 78.26,63.66 R49.2
N$47
  Bottom 0.381: U7.7 73.82,46.2 R13.1 76.51,46.2 76.52,46.2 76.91,46.59 76.91,62.94 76.2,63.66 R52.2
N$48
  Bottom 0.254: Y2.1 79.14,24.69 94.06,24.69 96.42,27.05 U4.7
N$49
  Bottom 0.254: U4.8 95.62,27.18 93.76,25.31 74.76,25.31 Y2.3
NRST  (1 unrouted)
  Bottom 0.254: S2.4 72.31,72.42 72.81,71.91 75.88,71.91 76.58,72.62 U10.7 | 71.91,68.65 70.97,68.65 67.43,72.19 67.43,87.51 61.12,93.82 J9.15
  Bottom 0.381: R38.1 71.91,68.32 | 71.91,68.32 71.91,68.65 | 71.91,68.32 S2.3
PWM_BRAKE  (via drill 0.35, 0.6)
  Top 0.254: v70.03,75.72 48.6,54.29 v37.31,54.29
  Bottom 0.254: U10.17 71,77.83 70.01,76.83 70.01,75.72 v70.03,75.72 | v37.31,54.29 37.31,51.28 36.04,50.01 R46.2
PWM_MOTOR  (via drill 0.35, 0.6)
  Top 0.254: v70.17,74.77 65.3,69.9 65.06,69.9 48.66,53.5 36.25,53.5 v36.17,53.58
  Bottom 0.254: U10.16 71.46,77.33 70.96,76.83 70.96,75.56 v70.17,74.77 | R48.2 36.12,53.58 v36.17,53.58
RST_ATM  (via drill 0.6)  (1 unrouted)
  Top 0.508: v116.52,31.43 116.52,30.48 115.89,29.84 90.01,29.84 v89.38,29.21
  Bottom 0.381: ISP1.5 88.9,29.69 v89.38,29.21 89.45,29.13 S1.1 | 115.97,31.98 108.19,31.98
  Bottom 0.508: U4.29 108.19,31.98 111.4,28.78 C1.1 | v116.52,31.43 115.97,31.98 | R9.1 89.42,23.02 S1.2
RX0_ATM
  Bottom 0.508: U4.30 106.77,31.18 109.54,28.42 R7.1
RX_ATM
  Bottom 0.254: Q3.3 R30.2 75.57,25.72 91.76,25.72 95.25,29.21 95.25,30.32 95.09,30.48 94.22,30.48 U4.10
RX_FTDI
  Bottom 0.381: U1.5 114.81,23.46 115.23,23.04 115.23,20.19 114.87,19.82 111.94,19.82 107.31,24.45 R8.2
SCK_ATM
  Bottom 0.152: 84.91,35.22 84.91,32.75
  Bottom 0.254: ISP1.3 84.93,30 83.03,30 82.39,30.64 82.39,32.07 83.03,32.7 84.86,32.7 84.91,32.75 | 84.91,35.22 86.37,36.68 U4.17
SCL
  Bottom 0.254: IC1.10 94.57,12.81 97.79,16.04 111.76,16.04 R1.1
  Bottom 0.381: R1.1 115.73,15.72 117.47,17.46 117.47,32.23
  Bottom 0.508: U4.28 116.92,32.78 117.47,32.23
SDA
  Bottom 0.254: IC1.9 85.86,13.31 85.57,13.02 85.57,12.38 85.81,12.13 94.84,12.13 97.95,15.24 110.17,15.24 R2.1
  Bottom 0.508: U4.27 117.39,33.58 118.27,32.7 118.27,16.82 114.78,13.33 R2.1
SPEED_SENSOR_DATA  (via drill 0.6)
  Top 0.381: v71.44,9.37 73.18,7.62 99.38,7.62 111.44,19.68 v116.52,19.68
  Bottom 0.381: R4.2 71.48,7.18 J3.2 71.48,8.85 71.44,8.89 v71.44,9.37 | v116.52,19.68 116.52,19.62 115.88,18.97 111.22,18.97 105.75,24.45 105.75,29.1 105.26,29.58 U4.32
STM_MISO
  Bottom 0.254: R17.1 71.91,86.93 75.08,83.76 U10.27
STM_MOSI
  Bottom 0.254: R19.1 74.14,85.41 75.58,83.96 U10.28
STM_NSS  (via drill 0.6)
  Top 0.254: v72.23,84.14 72.23,87.77 73.66,89.2 126.82,89.2 128.9,91.28 v128.9,91.92
  Bottom 0.254: U10.25 73.77,82.76 72.39,84.14 v72.23,84.14 | J5.1 134.14,97.15 v128.9,91.92
STM_RX  (via drill 0.6)
  Top 0.381: v76.2,85.41 77.63,83.98 77.63,45.24 v80.8,42.07
  Bottom 0.254: v76.2,85.41 76.2,84.77 77.08,83.89 U10.31 | Q1.3 R21.2
  Bottom 0.381: R21.2 80.96,41.91 v80.8,42.07
STM_SCK
  Bottom 0.254: R15.1 69.85,88.27 70.01,88.27 74.61,83.66 74.61,82.79 U10.26
STM_TX  (via drill 0.6)
  Top 0.381: v73.34,42.23 73.82,42.23 76.83,45.24 76.83,83.34 74.93,85.25 v74.93,86.68
  Bottom 0.254: v74.93,86.68 74.93,85.25 76.58,83.59 U10.30
  Bottom 0.381: v73.34,42.23 R25.2
TX0_ATM
  Bottom 0.508: U4.31 105.98,30.38 107.31,29.05 R8.1
TX_ATM
  Bottom 0.254: U4.9 90.79,26.25 82.01,26.25 80.32,27.94 R14.2
TX_FTDI
  Bottom 0.381: U1.1 112.19,20.86 112.18,20.85 109.54,23.49 R7.2
USBDM  (via drill 0.35, 0.6)
  Top 0.254: v77.47,86.68 79.37,86.68 80.17,85.88 94.14,85.88 v117.16,62.86
  Bottom 0.254: U10.32 77.58,84.03 77.48,84.13 77.48,86.67 v77.47,86.68 | v117.16,62.86 120.25,59.77 R24.1
USBDP  (via drill 0.35, 0.6)
  Top 0.254: v78.26,85.09 78.58,85.41 93.34,85.41 117.16,61.59 v117.16,60.96
  Bottom 0.254: U10.33 78.08,85.07 78.1,85.09 v78.26,85.09 | R27.1 117.16,60.8 v117.16,60.96
V_BRK
  Bottom 0.381: C9.1 66.67,33.65 66.67,42.54 68.58,44.45 82.39,44.45 83.34,45.4 83.34,45.72
  Bottom 0.508: 83.34,45.72 R41.2
  Bottom 1.778: J10.1 50.64,4.92 56.36,10.64 C9.1 54.45,23.34 49.26,18.15 U9.3
V_MOT
  Bottom 0.381: R16.2
  Bottom 0.508: R16.2 70.43,47.04 70.36,47.04 64.94,52.46 55.22,52.46 52.76,50.01 C7.1
  Bottom 1.778: C7.1 43.66,47.15 34.13,47.15 32.61,48.67 32.61,62.28 U8.1 46.51,76.19 C8.1 46.51,83.98 37.62,92.87 37.62,96.36 39.52,98.25 50.02,98.25 50.96,97.31 J6.1